# EAGLE design STM8 prog (EAGLE 6.5.0)
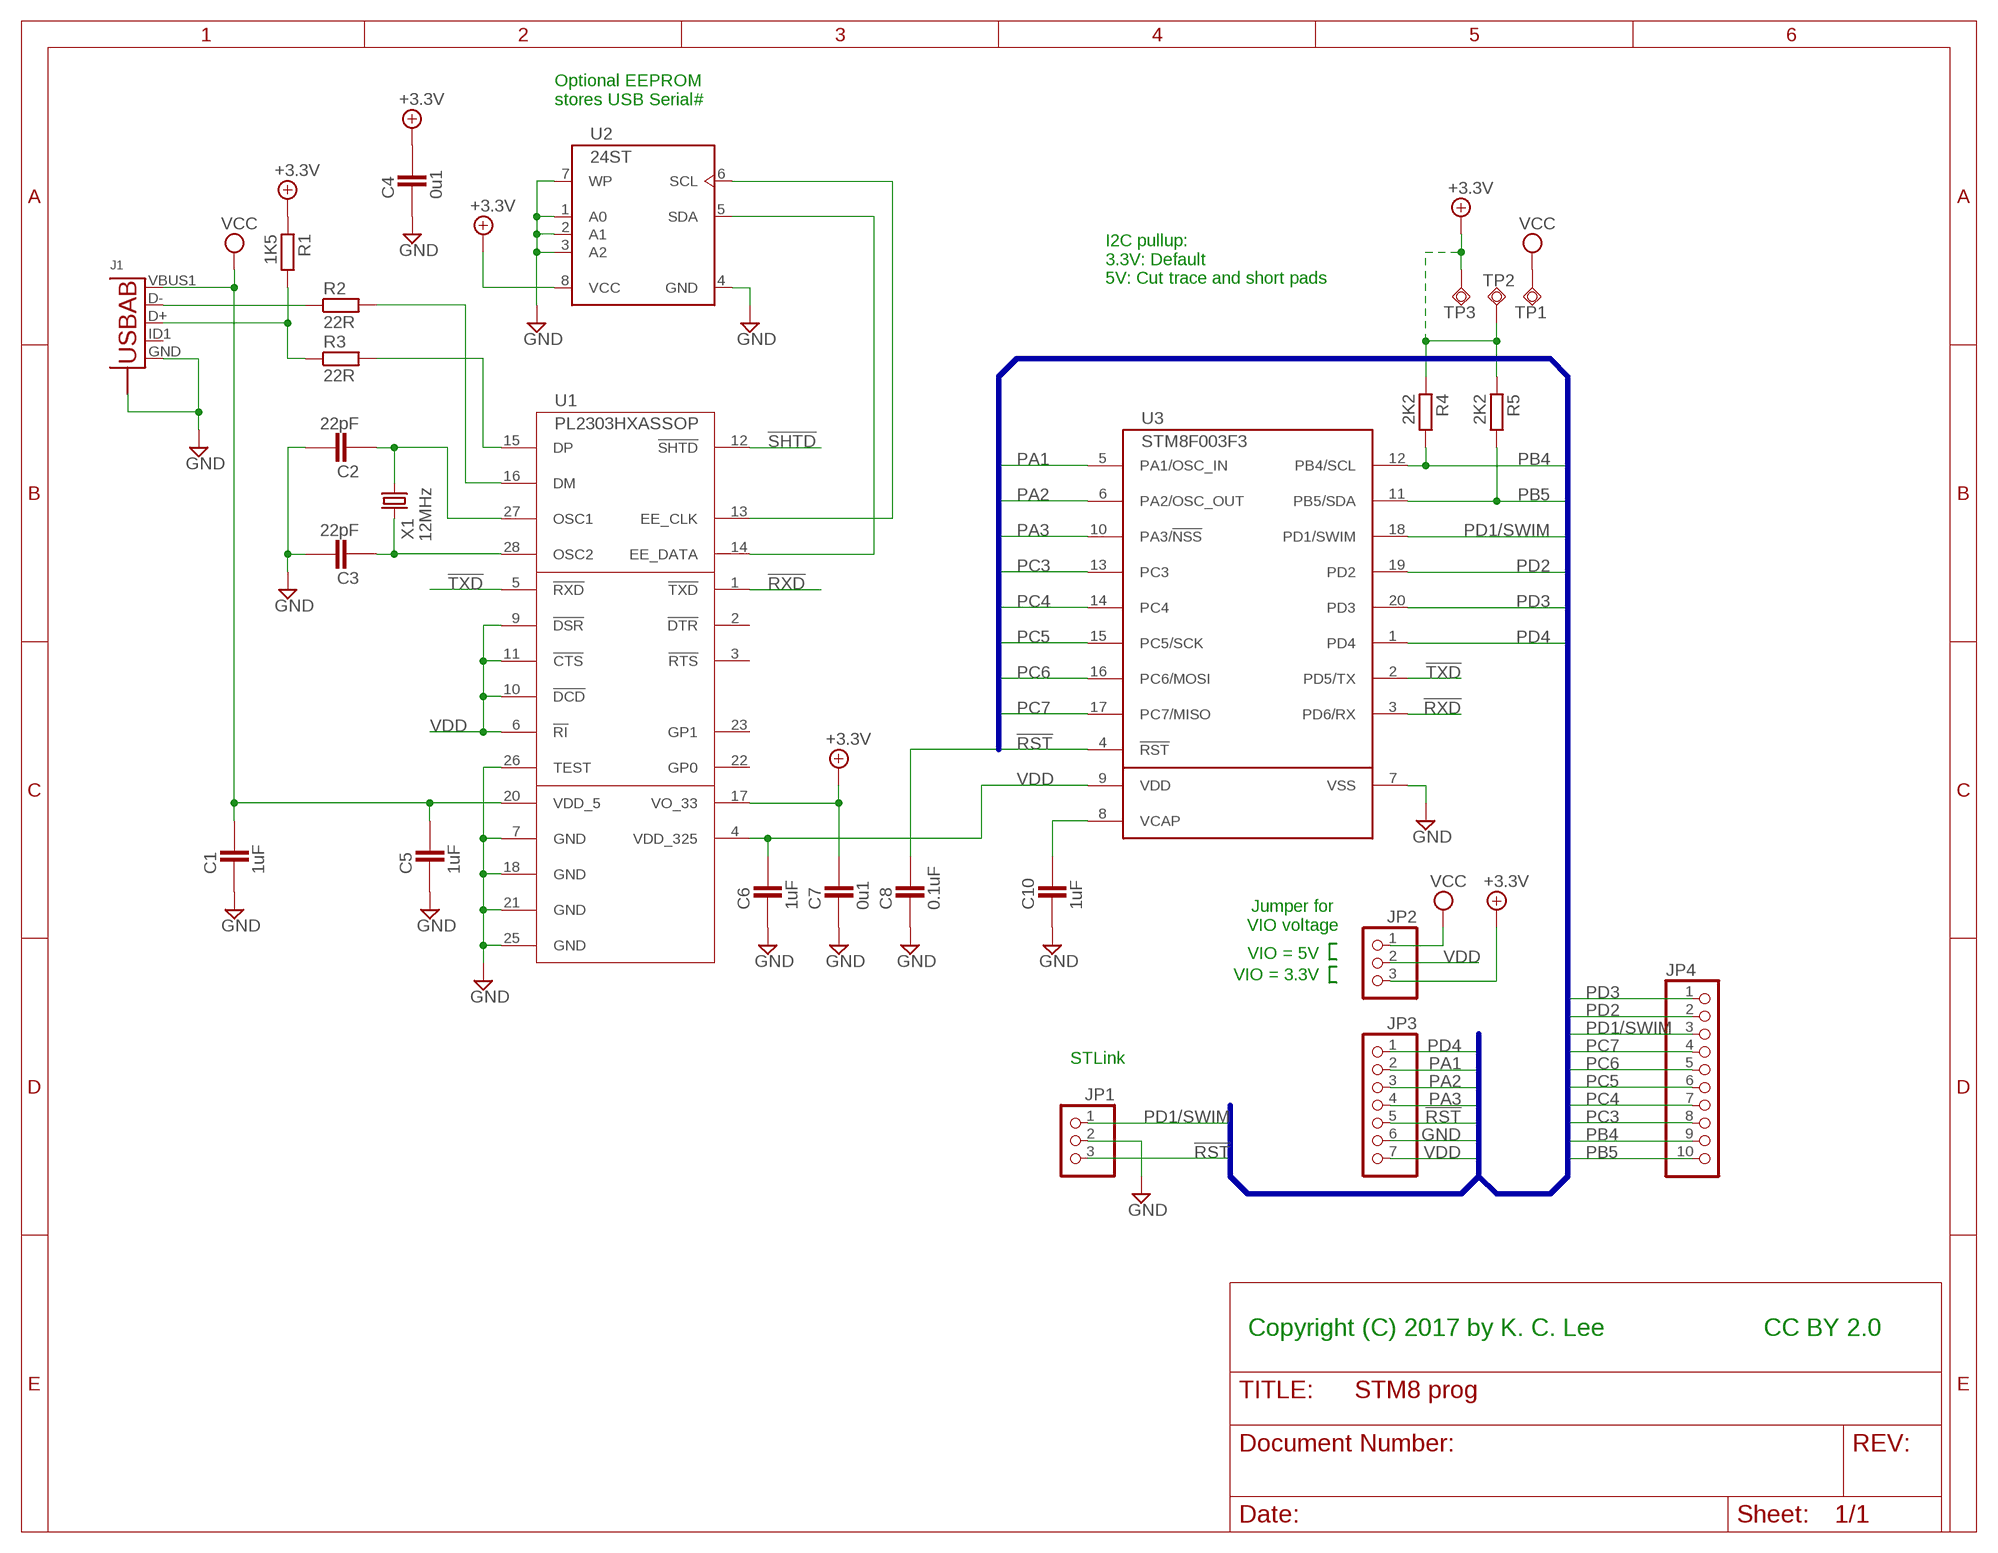
[diagram p0: schematic, sheet 1]

## Parts
C1  1uF  CAPACITOR_0603  [CAPC1608X92N]
C2  22pF  CAPACITOR_0603  [CAPC1608X92N]
C3  22pF  CAPACITOR_0603  [CAPC1608X92N]
C4  0u1  CAPACITOR_0603  [CAPC1608X92N]
C5  1uF  CAPACITOR_0603  [CAPC1608X92N]
C6  1uF  CAPACITOR_0603  [CAPC1608X92N]
C7  0u1  CAPACITOR_0603  [CAPC1608X92N]
C8  0.1uF  CAPACITOR_0603  [CAPC1608X92N]
C10  1uF  CAPACITOR_0603  [CAPC1608X92N]
J1  USB-ABBG  [USB-AB-MICRO-SMD_V03_SF]
JP1  PINHD-1X3  [1X03]
JP2  PINHD-1X3  [1X03]
JP3  PINHD-1X7_2.54  [1X07]
JP4  PINHD-1X10  [1X10]
R1  1K5  RESISTOR_0603  [RESC1608X55N]
R2  22R  RESISTOR_0603  [RESC1608X55N]
R3  22R  RESISTOR_0603  [RESC1608X55N]
R4  2K2  RESISTOR_0603  [RESC1608X55N]
R5  2K2  RESISTOR_0603  [RESC1608X55N]
TP1  TPSQTP09SQ  [TP09SQ]
TP2  TPSQTP09SQ  [TP09SQ]
TP3  TPSQTP09SQ  [TP09SQ]
U1  PL2303HXASSOP  [SSOP28DB]
U2  24ST  [TSSOP8]
U3  STM8F003F3  STM8SX03F3  [TSSOP20]
X1  12MHz  CRYSTALHC49U-V  [HC49U-V]

## Nets
!RST: C8.2 JP1.3 JP3.5 U3.4(!RST)
!RXD: U1.1(!TXD) U3.3(PD6/RX)
!SHTD: U1.12(!SHTD)
!TXD: U1.5(!RXD) U3.2(PD5/TX)
+3.3V: C4.2 C7.2 JP2.3 R1.1 R4.1 R5.1 TP2.TP TP3.TP U1.17(VO_33) U2.8(VCC)
GND: C1.1 C2.2 C3.2 C4.1 C5.1 C6.1 C7.1 C8.1 C10.1 J1.GND J1.S1(S) J1.S2(S) J1.S3(S) J1.S4(S) JP1.2 JP3.6 U1.7(GND) U1.18(GND) U1.21(GND) U1.25(GND) U1.26(TEST) U2.1(A0) U2.2(A1) U2.3(A2) U2.4(GND) U2.7(WP) U3.7(VSS)
N$2: C10.2 U3.8(VCAP)
N$4: R3.2 U1.15(DP)
N$5: J1.D+ R1.2 R3.1
N$6: J1.D- R2.1
N$7: R2.2 U1.16(DM)
N$8: U1.14(EE_DATA) U2.5(SDA)
N$9: U1.13(EE_CLK) U2.6(SCL)
N$13: C2.1 U1.27(OSC1) X1.1
N$14: C3.1 U1.28(OSC2) X1.2
PA1: JP3.2 U3.5(PA1/OSC_IN)
PA2: JP3.3 U3.6(PA2/OSC_OUT)
PA3: JP3.4 U3.10(PA3/!NSS)
PB4: JP4.9 R4.2 U3.12(PB4/SCL)
PB5: JP4.10 R5.2 U3.11(PB5/SDA)
PC3: JP4.8 U3.13(PC3)
PC4: JP4.7 U3.14(PC4)
PC5: JP4.6 U3.15(PC5/SCK)
PC6: JP4.5 U3.16(PC6/MOSI)
PC7: JP4.4 U3.17(PC7/MISO)
PD1/SWIM: JP1.1 JP4.3 U3.18(PD1/SWIM)
PD2: JP4.2 U3.19(PD2)
PD3: JP4.1 U3.20(PD3)
PD4: JP3.1 U3.1(PD4)
VCC: C1.2 C5.2 J1.VBUS1(VBUS) JP2.1 TP1.TP U1.20(VDD_5)
VDD: C6.2 JP2.2 JP3.7 U1.4(VDD_325) U1.6(!RI) U1.9(!DSR) U1.10(!DCD) U1.11(!CTS) U3.9(VDD)
Unconnected: J1.ID1(USBID) U1.2(!DTR) U1.3(!RTS) U1.22(GP0) U1.23(GP1)

## Buses
B$1

## Notes on the sheet
- Optional EEPROM
  stores USB Serial#
- I2C pullup:
  3.3V: Default
  5V: Cut trace and short pads
- Jumper for 
  VIO voltage
- VIO = 5V
- VIO = 3.3V
- STLink
- Copyright (C) 2017 by K. C. Lee | CC BY 2.0

## Library data of the parts
C1-C8 C10 = ipc-7351-capacitor:CAPACITOR_
J1 = Misc Conn:USB-AB: This is a USB AB connector that is compatible with USB OTG. i.e. this connector can serve as a host or device
JP1 JP2 = Misc Conn:PINHD-1X3: PIN HEADER
JP3 = Misc Conn:PINHD-1X7: PIN HEADER
JP4 = Misc Conn:PINHD-1X10: PIN HEADER
R1-R5 = ipc-7351-resistor:RESISTOR_
TP1-TP3 = testpad:TPSQ: Test pad
U1 = Misc Peripherals:PL2303HXA
U2 = Misc Memory:24*
U3 = Misc Processor:STM8SX03F
X1 = crystal:CRYSTAL: CRYSTAL; OC_FARNELL: 1666969; OC_NEWARK: unknown

## Board
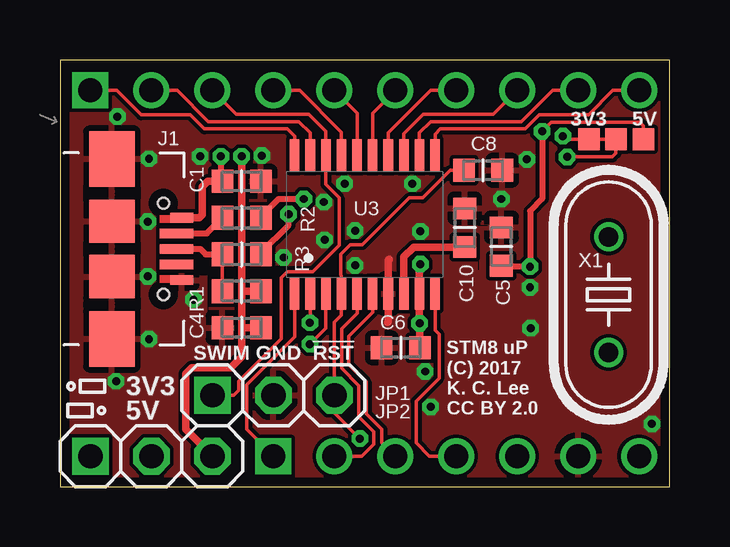
[diagram p1: board, top side]
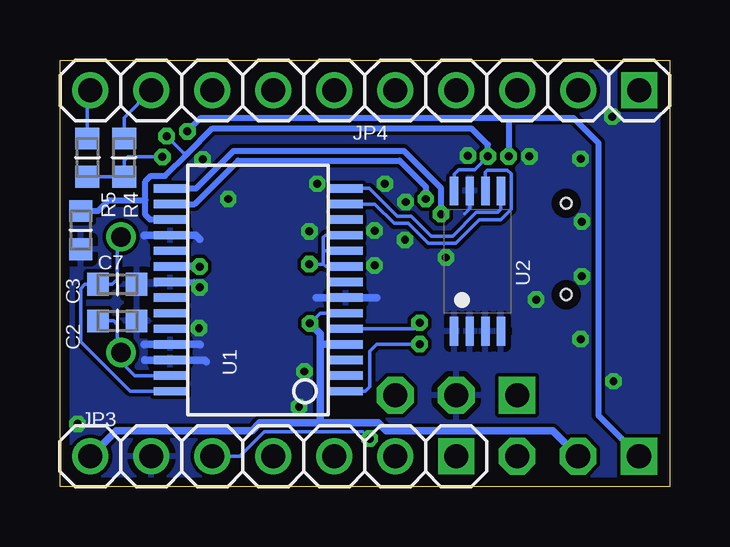
[diagram p2: board, bottom side, seen from below]

Size 25.4 x 17.78 mm. Coordinates in mm from the lower left corner, seen from the top.
Outline: 0,0 25.4,0 25.4,17.78 0,17.78 0,0
Copper layers (1*16): Top 0.0356mm / dielectric 1.5011mm / Bottom 0.0356mm
Design rules "oshpark-2layer-tented-vias *": minimum track width 6mil, minimum drill 13mil, track to track 6mil, track to pad 6mil, pad to pad 6mil, via to via 6mil, smd to smd 6mil, copper to edge 15mil, drill to drill 6mil, minimum pad ring 7mil, minimum via ring 7mil, stop-mask expansion 4mil, vias tented up to drill 13mil, thermal gap 10mil
tRestrict: 15 lines
bRestrict: 6 lines

### Footprints (pad centres in the part's own frame; a part is rotated, then mirrored left to right if it is on the bottom)
CAPC1608X92N = smd 0.9 x 0.95: 1 -0.8,0; 2 0.8,0
USB-AB-MICRO-SMD_V03_SF = smd 1.4 x 0.4: D+ 2.7,0; D- 2.7,0.65; ID1 2.7,-0.65 | smd 0.975 x 0.4: GND 2.913,-1.3; VBUS1 2.913,1.3 | smd 1.9 x 2.3: S1 0,3.75; S4 0,-3.75 | smd 1.9 x 1.8: S2 0,1.15; S3 0,-1.15 | hole 0.45: 2.15,1.9; 2.15,-1.9
1X03 = drill 1.016 square: 1 -2.54,0 | drill 1.016 octagon: 2 0,0; 3 2.54,0
1X07 = drill 1 square: 1 -7.62,0 | drill 1: 2 -5.08,0; 3 -2.54,0; 4 0,0; 5 2.54,0; 6 5.08,0; 7 7.62,0
1X10 = drill 1 square: 1 -11.43,0 | drill 1: 2 -8.89,0; 3 -6.35,0; 4 -3.81,0; 5 -1.27,0; 6 1.27,0; 7 3.81,0; 8 6.35,0; 9 8.89,0; 10 11.43,0
RESC1608X55N = smd 0.9 x 1: 1 -0.8,0; 2 0.8,0
TP09SQ = smd 0.9 x 0.9: TP 0,0
SSOP28DB = smd 0.348 x 1.397: 1 -4.225,-3.656; 2 -3.575,-3.656; 3 -2.925,-3.656; 4 -2.275,-3.656; 5 -1.625,-3.656; 6 -0.975,-3.656; 7 -0.325,-3.656; 8 0.325,-3.656; 9 0.975,-3.656; 10 1.625,-3.656; 11 2.275,-3.656; 12 2.925,-3.656; 13 3.575,-3.656; 14 4.225,-3.656; 15 4.225,3.656; 16 3.575,3.656; 17 2.925,3.656; 18 2.275,3.656; 19 1.625,3.656; 20 0.975,3.656; 21 0.325,3.656; 22 -0.325,3.656; 23 -0.975,3.656; 24 -1.625,3.656; 25 -2.275,3.656; 26 -2.925,3.656; 27 -3.575,3.656; 28 -4.225,3.656
TSSOP8 = smd 0.35 x 1.2: 1 -0.975,-2.925; 2 -0.325,-2.925; 3 0.325,-2.925; 4 0.975,-2.925; 5 0.975,2.925; 6 0.325,2.925; 7 -0.325,2.925; 8 -0.975,2.925
TSSOP20 = smd 0.4 x 1.35: 1 -2.925,-2.875; 2 -2.275,-2.875; 3 -1.625,-2.875; 4 -0.975,-2.875; 5 -0.325,-2.875; 6 0.325,-2.875; 7 0.975,-2.875; 8 1.625,-2.875; 9 2.275,-2.875; 10 2.925,-2.875; 11 2.925,2.875; 12 2.275,2.875; 13 1.625,2.875; 14 0.975,2.875; 15 0.325,2.875; 16 -0.325,2.875; 17 -0.975,2.875; 18 -1.625,2.875; 19 -2.275,2.875; 20 -2.925,2.875
HC49U-V = drill 0.813: 1 -2.413,0; 2 2.413,0

### Placement (x,y rotation side)
C1  7.57,12.73 180 top
C2  23.01,6.91 0 bottom
C3  23.01,8.43 0 bottom
C4  7.57,6.63 0 top
C5  18.39,10.01 270 top
C6  14.2,5.79 0 top
C7  24.54,10.69 90 bottom
C8  17.63,13.18 180 top
C10  16.87,10.79 270 top
J1  2.16,9.91 0 top
JP1  8.89,3.81 0 top
JP2  3.81,1.27 0 top
JP3  16.51,1.27 180 bottom
JP4  12.7,16.51 180 bottom
R1  7.57,8.15 180 top
R2  7.57,11.2 0 top
R3  7.57,9.68 0 top
R4  22.73,13.72 90 bottom
R5  24.26,13.72 90 bottom
TP1  24.31,14.48 0 top
TP2  22.05,14.48 0 top
TP3  23.16,14.48 0 top
U1  17.14,8.2 90 bottom
U2  8,9.4 0 bottom
U3  12.7,10.92 0 top
X1  22.86,8 90 top

### Tracks (layer width: path | path; a pad name or v marks a point on that pad's centre or on a via)
!RST  (via drill 0.33)
  Top 0.152: C8.2 16.26,13.18 15.11,12.04 14.55,12.04 12.6,10.08 12.09,10.08 11.7,9.69 11.7,8.82 11.72,8.8 U3.4 11.72,7.15 11.43,6.86 JP1.3 11.43,3.07 v12.5,2.01
  Bottom 0.152: JP3.5 17.91,1.27 16.89,2.29 12.78,2.29 v12.5,2.01
!RXD  (via drill 0.33)
  Top 0.152: U3.3 11.07,6.61 v10.41,5.94
  Bottom 0.152: v10.41,5.94 12.19,5.94 12.5,5.64 12.5,4.17 12.68,3.98 U1.1
!TXD  (via drill 0.33)
  Top 0.152: U3.2 10.43,6.84 v10.41,6.83
  Bottom 0.152: v10.41,6.83 10.67,6.58 U1.5
+3.3V  (via drill 0.33)
  Top 0.152: v20.95,14.61 21.08,14.48 TP2.TP TP3.TP 23.16,13.89 23.01,13.74 v21.13,13.74
  Top 0.305: 7.57,6.6 7.57,5.41 7.11,4.95 5.49,4.95 5.23,4.7 5.23,2.39 JP2.3 | 7.57,6.6 7.57,8.13 | 7.57,8.13 v7.57,13.77 | R1.1 7.59,8.15 7.57,8.13 | C4.2 7.59,6.63 7.57,6.6
  Bottom 0.152: v7.57,13.77 8.13,13.21 8.79,13.21 8.98,13.02 U2.8 | R5.1 R4.1 22.73,13.59 22.58,13.74 v21.13,13.74 | v20.95,14.61 20.23,13.88 20.1,13.88
  Bottom 0.254: U1.17 21.64,11.13 21.84,11.33 21.84,11.94 | v7.57,13.77 7.57,14.25 8.26,14.94 19.05,14.94 20.1,13.88 21.03,12.95 21.61,12.95 21.84,12.72 21.84,11.94 | C7.2 23.81,11.49 23.37,11.94 21.84,11.94
GND  (via drill 0.33)
  Top 0.305: 13.66,6.86 13.68,6.87 U3.7 13.68,9.43 13.72,9.47
  Bottom 0.152: U2.7 8.33,11.59 8.53,11.38
  Bottom 0.254: U1.21 19.81,8.53 v19.58,8.31
  Bottom 0.305: 19.58,10.31 19.75,10.48 U1.18 21.86,10.48 | 21.88,10.48 21.89,10.46 | 21.89,5.94 21.89,5.92 21.88,5.93 U1.25 19.57,5.93 19.56,5.92 | 21.87,5.28 21.86,5.28 U1.26 19.38,5.28 19.3,5.21 | 14.73,7.87 14.73,7.88 U1.7 12.2,7.88 12.19,7.87
  other vias: 12.29,10.67 8.41,13.79 3.66,11.05 3.71,6.15 3.71,13.67 19.46,13.64 14.68,12.62 11.86,12.62 11,11.86 18.39,11.99 15.21,4.8 2.34,4.39 2.39,15.42 19.61,6.6 5.84,13.77 5.56,7.8 24.66,2.62 15.44,3.33 9.32,9.55 12.29,9.22 3.66,8.76 15.01,10.64 11.02,10.29
  pour Top: 0,17.78 25.4,17.78 25.4,0 0,0
  pour Bottom: 25.4,17.78 0,17.78 0,0 25.4,0
N$2
  Top 0.305: U3.8 14.32,9.57 14.73,9.98 16.85,9.98 C10.2
N$4  (via drill 0.33)
  Top 0.254: R3.2 8.37,9.74 9.53,10.9 v9.53,11.35
  Bottom 0.254: U1.15 19.73,12.43 18.16,13.99 11.07,13.99 9.53,12.45 v9.53,11.35
N$5
  Top 0.152: R1.2 R3.1
  Top 0.254: J1.D+ 5.84,9.91 6.07,9.68 R3.1
N$6
  Top 0.254: J1.D- 6.12,10.56 R2.1
N$7  (via drill 0.33)
  Top 0.254: R2.2 8.37,11.24 9.12,11.99 v10.16,11.99
  Bottom 0.254: U1.16 19.79,11.78 17.98,13.59 11.25,13.59 10.16,12.5 v10.16,11.99
N$8
  Bottom 0.152: U1.14 12.51,12.43 11.35,11.28 10.77,11.28 9.93,10.44 9.04,10.44 8.05,11.43 7.16,11.43 7.03,11.57 U2.5
N$9
  Bottom 0.152: U2.6 7.68,13.1 7.59,13.18 6.76,13.18 6.6,13.03 6.6,11.56 7.04,11.12 7.92,11.12 8.91,10.13 10.06,10.13 10.9,10.97 11.48,10.97 12.29,11.78 U1.13
N$13
  Bottom 0.152: C2.1 23.16,6.91 23.01,6.76 23.01,5.74 X1.1 22.86,5.21 22.28,4.63 U1.27
N$14
  Bottom 0.152: U1.28 22.47,3.98 24.54,6.04 24.54,8.26 24.36,8.43 C3.1 23.22,8.43 23.01,8.64 23.01,10.26 X1.2
PA1
  Top 0.152: U3.5 12.38,7.22 11.73,6.58 11.73,4.93 12.45,4.22 12.45,2.92 13.08,2.29 13.08,1.78 12.57,1.27 JP3.2
PA2
  Top 0.152: U3.6 13.03,7.26 12.04,6.27 12.04,5.08 12.75,4.37 12.75,3.05 13.41,2.39 13.41,1.83 JP3.3
PA3
  Top 0.152: JP3.4 15.39,1.27 14.83,1.83 14.83,3.56 15.8,4.52 15.8,6.35 15.62,6.52 U3.10
PB4
  Top 0.152: U3.12 14.97,14.75 15.44,15.21 19.23,15.21 20.52,16.51 JP4.9
  Bottom 0.152: R4.2 22.73,15.37 JP4.9
PB5
  Top 0.152: U3.11 15.62,14.69 15.85,14.91 19.38,14.91 19.96,15.49 22.02,15.49 23.04,16.51 JP4.10
  Bottom 0.152: R5.2 24.26,16.38 JP4.10
PC3
  Top 0.152: U3.13 14.32,14.71 15.14,15.52 18.06,15.52 JP4.8
PC4
  Top 0.152: U3.14 13.68,14.74 15.44,16.51 JP4.7
PC5
  Top 0.152: U3.15 13.03,15.56 JP4.6
PC6
  Top 0.152: U3.16 12.38,15.56 JP4.5
PC7
  Top 0.152: U3.17 11.72,14.77 9.98,16.51 JP4.4
PD1/SWIM
  Top 0.152: JP4.3 7.34,15.52 10.36,15.52 11.07,14.81 U3.18 11.07,12.6 11.63,12.04 11.63,10.06 10.54,8.97 9.47,8.97 9.22,8.71 9.22,6.17 7.44,4.39 7.44,4.01 7.24,3.81 JP1.1
PD2
  Top 0.152: U3.19 10.43,14.75 9.96,15.21 6.17,15.21 4.88,16.51 JP4.2
PD3
  Top 0.152: U3.20 9.78,14.61 9.47,14.91 6.02,14.91 5.44,15.49 3.38,15.49 2.36,16.51 JP4.1
PD4
  Top 0.152: U3.1 9.78,6.24 7.77,4.24 7.77,2.39 JP3.1
VCC  (via drill 0.33)
  Top 0.152: v20.09,14.81 20.47,15.19 24.16,15.19 24.31,15.04 TP1.TP
  Top 0.254: v20.09,14.81 20.09,11.99 19.58,11.48 v19.58,9.17 18.43,9.17 C5.2 | v6.71,13.77 6.71,12.79 C1.2
  Top 0.305: J1.VBUS1 5.8,11.21 5.92,11.33 5.92,12.5 6.15,12.72 C1.2
  Bottom 0.254: v20.09,14.81 19.53,15.37 6.71,15.37 | 6.71,15.37 v6.71,13.77 | 6.71,15.37 4.01,15.37 2.97,14.33 2.97,2.97 JP2.1
  Bottom 0.305: U1.20 19.59,9.18 v19.58,9.17
VDD  (via drill 0.33)
  Top 0.305: 14.97,6.86 U3.9 14.97,9.23 v15.01,9.27 | 14.97,6.86 14.97,6.8 v14.99,6.81 15,6.79 C6.2 | 15,6.83 14.97,6.86
  Bottom 0.152: U1.9 14.34,9.18 14.43,9.27 | 14.43,9.27 v15.01,9.27 | U1.11 14.34,10.48 14.43,10.39 14.43,9.83 | 14.54,5.93 14.55,5.94 | U1.6 14.56,7.23 v14.99,6.81 | 14.43,9.83 14.43,9.27 | U1.10 14.43,9.83
  Bottom 0.305: JP2.2 4.88,2.34 11.81,2.34 12.14,2.67 14.55,2.67 | v14.99,6.81 14.55,6.38 14.55,5.94 14.55,2.67 | U1.4 14.47,5.93 14.48,5.92 14.49,5.93 14.54,5.93 | 14.55,2.67 17.07,2.67 17.4,2.34 23.06,2.34 JP3.7

### Text on the board
tPlace: 3V3 | 5V | SWIM GND !RST | 3V3 | 5V | STM8 uP / (C) 2017 / K. C. Lee / CC BY 2.0